# Altium schematic sheet drv8305_instaspin_driver_adapter.SchDoc
size A4
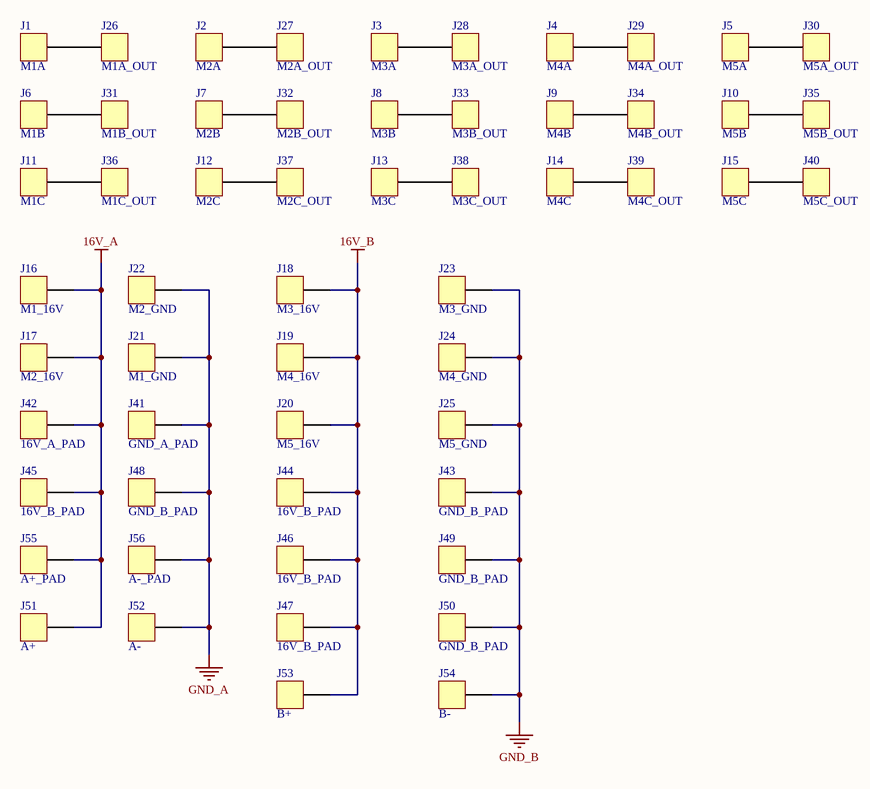
[diagram p0: drv8305_instaspin_driver_adapter.SchDoc]

## Parts
J1  M1A  [2MM-BULLET-PLUG-VIA]
J2  M2A  [2MM-BULLET-PLUG-VIA]
J3  M3A  [2MM-BULLET-PLUG-VIA]
J4  M4A  [2MM-BULLET-PLUG-VIA]
J5  M5A  [2MM-BULLET-PLUG-VIA]
J6  M1B  [2MM-BULLET-PLUG-VIA]
J7  M2B  [2MM-BULLET-PLUG-VIA]
J8  M3B  [2MM-BULLET-PLUG-VIA]
J9  M4B  [2MM-BULLET-PLUG-VIA]
J10  M5B  [2MM-BULLET-PLUG-VIA]
J11  M1C  [2MM-BULLET-PLUG-VIA]
J12  M2C  [2MM-BULLET-PLUG-VIA]
J13  M3C  [2MM-BULLET-PLUG-VIA]
J14  M4C  [2MM-BULLET-PLUG-VIA]
J15  M5C  [2MM-BULLET-PLUG-VIA]
J16  M1_16V  [2MM-BULLET-PLUG-VIA]
J17  M2_16V  [2MM-BULLET-PLUG-VIA]
J18  M3_16V  [2MM-BULLET-PLUG-VIA]
J19  M4_16V  [2MM-BULLET-PLUG-VIA]
J20  M5_16V  [2MM-BULLET-PLUG-VIA]
J21  M1_GND  [2MM-BULLET-PLUG-VIA]
J22  M2_GND  [2MM-BULLET-PLUG-VIA]
J23  M3_GND  [2MM-BULLET-PLUG-VIA]
J24  M4_GND  [2MM-BULLET-PLUG-VIA]
J25  M5_GND  [2MM-BULLET-PLUG-VIA]
J26  M1A_OUT  [POWER-PAD]
J27  M2A_OUT  [POWER-PAD]
J28  M3A_OUT  [POWER-PAD]
J29  M4A_OUT  [POWER-PAD]
J30  M5A_OUT  [POWER-PAD]
J31  M1B_OUT  [POWER-PAD]
J32  M2B_OUT  [POWER-PAD]
J33  M3B_OUT  [POWER-PAD]
J34  M4B_OUT  [POWER-PAD]
J35  M5B_OUT  [POWER-PAD]
J36  M1C_OUT  [POWER-PAD]
J37  M2C_OUT  [POWER-PAD]
J38  M3C_OUT  [POWER-PAD]
J39  M4C_OUT  [POWER-PAD]
J40  M5C_OUT  [POWER-PAD]
J41  GND_A_PAD  [POWER-PAD]
J42  16V_A_PAD  [POWER-PAD]
J43  GND_B_PAD  [POWER-PAD]
J44  16V_B_PAD  [POWER-PAD]
J45  16V_B_PAD  [POWER-PAD]
J46  16V_B_PAD  [POWER-PAD]
J47  16V_B_PAD  [POWER-PAD]
J48  GND_B_PAD  [POWER-PAD]
J49  GND_B_PAD  [POWER-PAD]
J50  GND_B_PAD  [POWER-PAD]
J51  A+  [2MM-BANANA-VIA]
J52  A-  [2MM-BANANA-VIA]
J53  B+  [2MM-BANANA-VIA]
J54  B-  [2MM-BANANA-VIA]
J55  A+_PAD  [POWER-PAD]
J56  A-_PAD  [POWER-PAD]

## Nets
16V_A: J16.1 J17.1 J42.1 J45.1 J51.1 J55.1
16V_B: J18.1 J19.1 J20.1 J44.1 J46.1 J47.1 J53.1
GND_A: J21.1 J22.1 J41.1 J48.1 J52.1 J56.1
GND_B: J23.1 J24.1 J25.1 J43.1 J49.1 J50.1 J54.1
NetJ1_1: J1.1 J26.1
NetJ2_1: J2.1 J27.1
NetJ3_1: J3.1 J28.1
NetJ4_1: J4.1 J29.1
NetJ5_1: J5.1 J30.1
NetJ6_1: J6.1 J31.1
NetJ7_1: J7.1 J32.1
NetJ8_1: J8.1 J33.1
NetJ9_1: J9.1 J34.1
NetJ10_1: J10.1 J35.1
NetJ11_1: J11.1 J36.1
NetJ12_1: J12.1 J37.1
NetJ13_1: J13.1 J38.1
NetJ14_1: J14.1 J39.1
NetJ15_1: J15.1 J40.1

## Library data of the parts
J1-J56 = HEADER-1